# Altium schematic sheet MCU.SchDoc: =ProjectName
size A4; CheckedBy: DatNB; Author: Ven; CompanyName: Nacentech; Organization: IMET
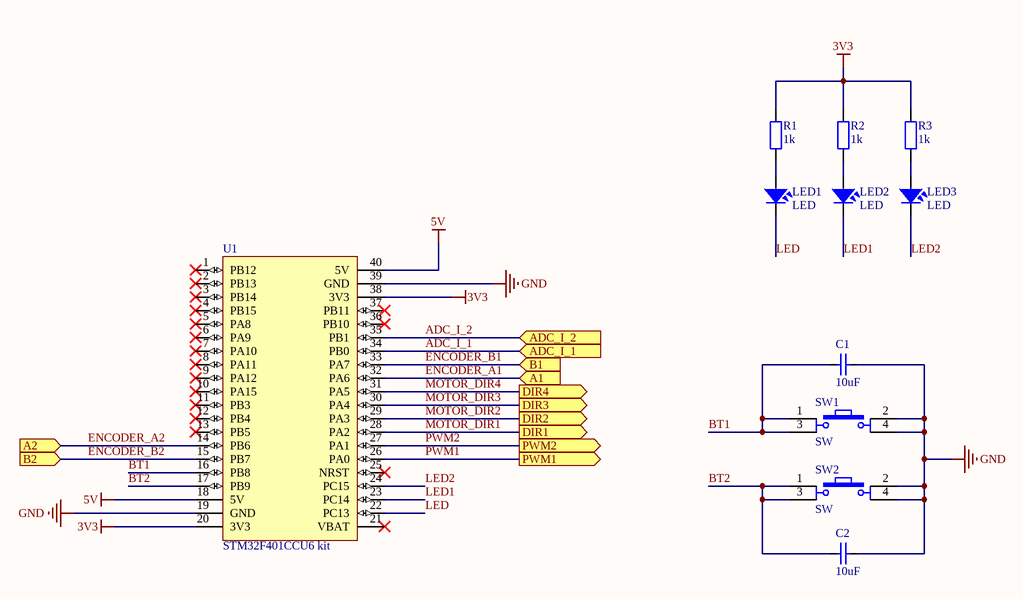
[diagram p0: MCU.SchDoc]

## Parts
C1  10uF  [CAP_0805]
C2  10uF  [CAP_0805]
LED1  LED  [LED-0805-Red]
LED2  LED  [LED-0805-Orange]
LED3  LED  [LED-0805-Green]
R1  1k  [RES-SMD-0805]
R2  1k  [RES-SMD-0805]
R3  1k  [RES-SMD-0805]
SW1  SW  [SW4]
SW2  SW  [SW4]
U1  STM32F401CCU6 kit  [STM32F401 KIT]

## Ports
A1 (in), A2 (in), ADC_I_1 (in), ADC_I_2 (in), B1 (in), B2 (in), DIR1 (out), DIR2 (out), DIR3 (out), DIR4 (out), PWM1 (out), PWM2 (out)

## Nets
3V3: R1.1 R2.1 R3.1 U1.20(3V3) U1.38(3V3)
5V: U1.18(5V) U1.40(5V)
GND: C1.2 C2.2 SW1.2 SW1.4 SW2.2 SW2.4 U1.19(GND) U1.39(GND)
ADC_I_1: U1.34(PB0) ; port ADC_I_1
ADC_I_2: U1.35(PB1) ; port ADC_I_2
BT1: C1.1 SW1.1 SW1.3 U1.16(PB8)
BT2: C2.1 SW2.1 SW2.3 U1.17(PB9)
ENCODER_A1: U1.32(PA6) ; port A1
ENCODER_A2: U1.14(PB6) ; port A2
ENCODER_B1: U1.33(PA7) ; port B1
ENCODER_B2: U1.15(PB7) ; port B2
LED: LED1.2 U1.22(PC13)
LED1: LED2.2 U1.23(PC14)
LED2: LED3.2 U1.24(PC15)
MOTOR_DIR1: U1.28(PA2) ; port DIR1
MOTOR_DIR2: U1.29(PA3) ; port DIR2
MOTOR_DIR3: U1.30(PA4) ; port DIR3
MOTOR_DIR4: U1.31(PA5) ; port DIR4
PWM1: U1.26(PA0) ; port PWM1
PWM2: U1.27(PA1) ; port PWM2
NetLED1_1: LED1.1 R1.2
NetLED2_1: LED2.1 R2.2
NetLED3_1: LED3.1 R3.2

Not connected (* = marked no-connect by the designer): U1 1(PB12)* 2(PB13)* 3(PB14)* 4(PB15)* 5(PA8)* 6(PA9)* 7(PA10)* 8(PA11)* 9(PA12)* 10(PA15)* 11(PB3)* 12(PB4)* 13(PB5)* 21(VBAT)* 25(NRST)* 36(PB10)* 37(PB11)*

## Notes on the sheet
- Project:
- Page Contents:
- Size:
- Date:
- A4
- Checked by:
- Time:
- Revision:
- Sheet
- of
- File:

## Library data of the parts
C1 C2 = CapSMD: Capacitor; Value: 33p; Published: 8-Jun-2000; LatestRevisionDate: 17-Jul-2002; LatestRevisionNote: Re-released for DXP Platform.; PackageReference: RAD-0.3; Publisher: Altium Limited
LED1-LED3 = LED: LED Single colour Green and Red; Value: LED 3 ly Single Colour
R1-R3 = Resistor - SMD: Resistor SMD; Manufacturer: Generic Components; Class: Passive; Published: 08/06/2000; Publisher: Altium Hobart Technology Centre
SW1 SW2 = SW4: Switch button 4 pin; Value: Button chip 4 pin
U1 = STM32F401CCU6: STM32F401CCU6 breakout board. STM32 ARM-based 32-bit MCU